# EAGLE design battery_weld (EAGLE 8.0.1)
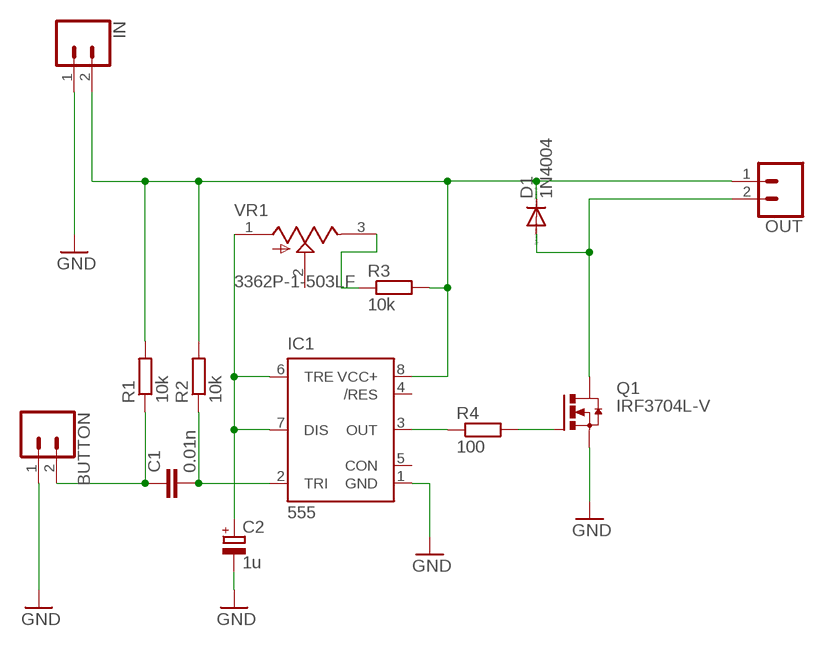
[diagram p0: schematic, sheet 1]

## Parts
BUTTON  CONN_02  [1X02]
C1  0.01n  C-EUC1206K  [C1206K]
C2  1u  CPOL-EUE2-4  [E2-4]
D1  1N4004  [DO41-10]
IC1  555  555D  [SO08]
IN  CONN_025MM  [SCREWTERMINAL-5MM-2]
OUT  CONN_025MM  [SCREWTERMINAL-5MM-2]
Q1  IRF3704L-V  [TO262-V]
R1  10k  R-EU_M1206  [M1206]
R2  10k  R-EU_M1206  [M1206]
R3  10k  R-EU_M1206  [M1206]
R4  100  R-EU_M1206  [M1206]
VR1  3362P-1-503LF  [TRIM_3362P-1-503LF]

## Nets
GND: BUTTON.1 C2.- IC1.1(GND) IN.1 Q1.3(S)
N$1: BUTTON.2 C1.1 R1.1
N$2: C1.2 IC1.2(TRI) R2.1
N$3: C2.+ IC1.6(TRE) IC1.7(DIS) VR1.1(CCW)
N$4: R3.1 VR1.3(CW)
N$6: D1.C IC1.8(VCC+) IN.2 OUT.1 R1.2 R2.2 R3.2
N$7: D1.A OUT.2 Q1.2(D)
N$8: Q1.1(G) R4.2
N$9: IC1.3(OUT) R4.1
Unconnected: IC1.4(/RES) IC1.5(CON) VR1.2(WIPER)

## Library data of the parts
BUTTON = SparkFun-Connectors:CONN_02: Multi connection point. Often used as Generic Header-pin footprint for 0.1 inch spaced/style header connections On any of the 0.1 inch spaced packages, you can populate with these: Break Away Headers - Straight <https://www.sparkfun.com/products/116> (PRT-00116) Break Away Male Headers - Right Angle <https://www.sparkfun.com/products/553> (PRT-00553) Female Headers <https://www.sparkfun.com/products/115> (PRT-00115) Break Away Headers - Machine Pin <https://www.sparkfun.com/products/117> (PRT-00117) Break Away Female Headers - Swiss Machine Pin <https://www.sparkfun.com/products/743> (PRT-00743) For SCREWTERMINALS and SPRING TERMINALS visit here: Screw Terimnals on SparkFun.com <https://www.sparkfun.com/search/results?term=Screw+Terminals> (5mm/3.5mm/2.54mm spacing) This device is also useful as a general connection point to wire up your design to another part of your project. Our various solder wires solder well into these plated through hole pads. Hook-Up Wire - Assortment (Stranded, 22 AWG) <https://www.sparkfun.com/products/11375> (PRT-11375) Hook-Up Wire - Assortment (Solid Core, 22 AWG) <https://www.sparkfun.com/products/11367> (PRT-11367) View the entire wire category on our website here <https://www.sparkfun.com/categories/141> Special notes: Molex polarized connector foot print use with: PRT-08233 with associated crimp pins and housings. 2.54_SCREWTERM for use with PRT-10571. 3.5mm Screw Terminal footprints for PRT-08084 5mm Screw Terminal footprints for use with PRT-08432
C1 = rcl:C-EU: CAPACITOR, European symbol
C2 = rcl:CPOL-EU: POLARIZED CAPACITOR, European symbol
D1 = diode:1N4004: DIODE general purpose rectifier, 1 A
IC1 = SparkFun-IC-Special-Function:555: General purpose bipolar Timer Datasheet <http://www.sparkfun.com/datasheets/Components/General/ne555.pdf> SparkFun Products SparkFun SparkPunk Sequencer Kit <https://www.sparkfun.com/products/12707> (KIT-12707) Storefront Component: 555 Timer <https://www.sparkfun.com/products/9273> (COM-09273) Two parts valid for production: VFP: IC-11930 (M7555 PTH) VFP: IC-09173 (555 PTH) - Preferred; PROD_ID: NA-XXXXX
IN OUT = SparkFun-Connectors:CONN_02: Multi connection point. Often used as Generic Header-pin footprint for 0.1 inch spaced/style header connections On any of the 0.1 inch spaced packages, you can populate with these: Break Away Headers - Straight <https://www.sparkfun.com/products/116> (PRT-00116) Break Away Male Headers - Right Angle <https://www.sparkfun.com/products/553> (PRT-00553) Female Headers <https://www.sparkfun.com/products/115> (PRT-00115) Break Away Headers - Machine Pin <https://www.sparkfun.com/products/117> (PRT-00117) Break Away Female Headers - Swiss Machine Pin <https://www.sparkfun.com/products/743> (PRT-00743) For SCREWTERMINALS and SPRING TERMINALS visit here: Screw Terimnals on SparkFun.com <https://www.sparkfun.com/search/results?term=Screw+Terminals> (5mm/3.5mm/2.54mm spacing) This device is also useful as a general connection point to wire up your design to another part of your project. Our various solder wires solder well into these plated through hole pads. Hook-Up Wire - Assortment (Stranded, 22 AWG) <https://www.sparkfun.com/products/11375> (PRT-11375) Hook-Up Wire - Assortment (Solid Core, 22 AWG) <https://www.sparkfun.com/products/11367> (PRT-11367) View the entire wire category on our website here <https://www.sparkfun.com/categories/141> Special notes: Molex polarized connector foot print use with: PRT-08233 with associated crimp pins and housings. 2.54_SCREWTERM for use with PRT-10571. 3.5mm Screw Terminal footprints for PRT-08084 5mm Screw Terminal footprints for use with PRT-08432; SF_SKU: PRT-08432
Q1 = transistor-power:IRF3704: SMPS MOSFET HEXFET® Power MOSFET Source: http://www.irf.com/product-info/datasheets/data/irf3704.pdf
R1-R4 = resistor:R-EU_: RESISTOR, European symbol
VR1 = 3362P-1-503LF:3362P-1-503LF: Res Cermet Trimmer 50K Ohm 10% 1/2W 1(Elec)/1(Mech)Turn 2.77mm (6.6 X 6.99 X 4.7mm) Pin Thru-Hole Tube; AVAILABILITY: Unavailable; DESCRIPTION: Res Cermet Trimmer 50K Ohm 10% 1/2W 1_Elec_/1_Mech_Turn 2.77mm _6.6 X 6.99 X 4.7mm_ Pin Thru-Hole Tube; MF: Bourns; MP: 3362P-1-503LF; PACKAGE: Bourns; PRICE: None

## Board
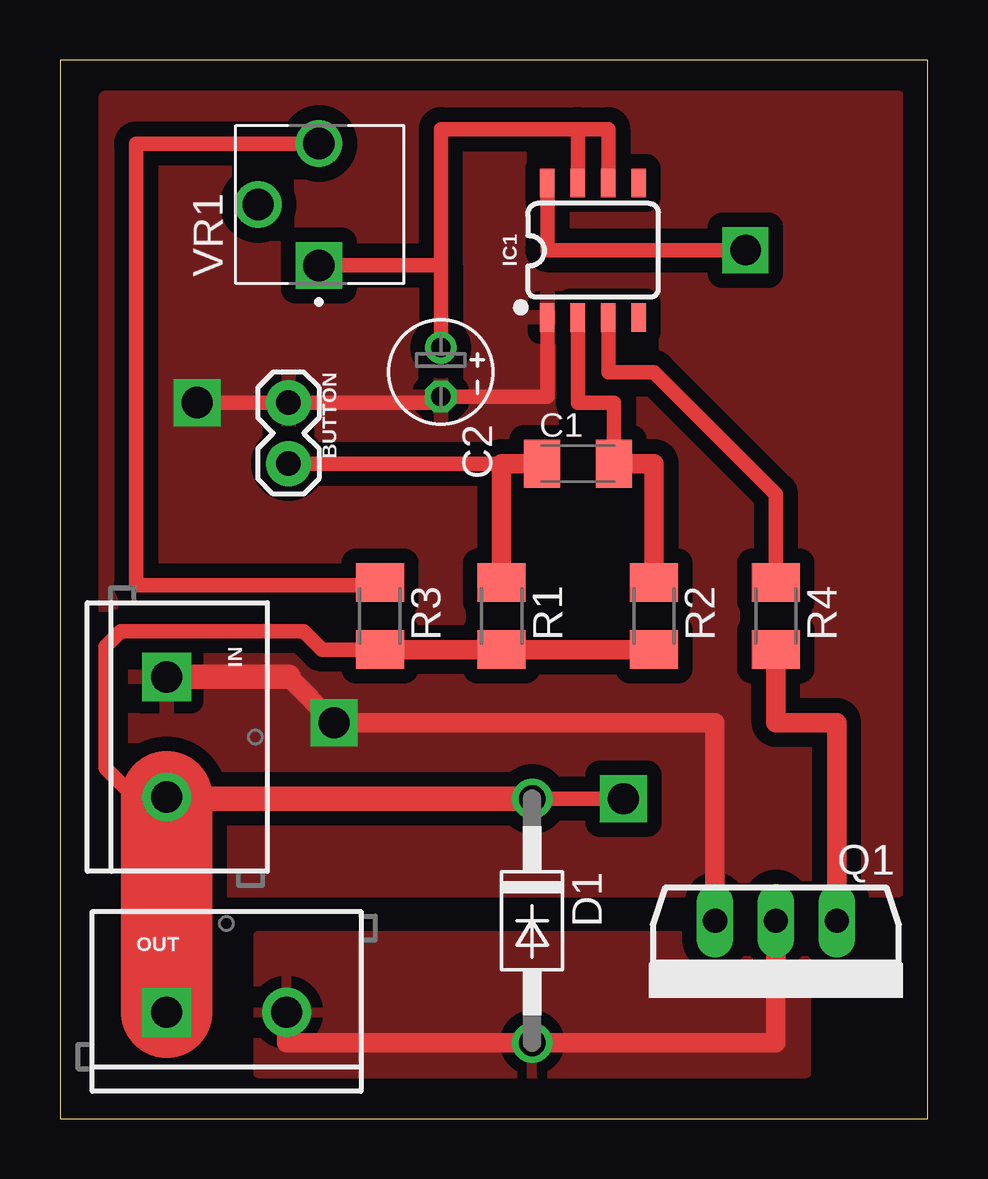
[diagram p1: board, top side]
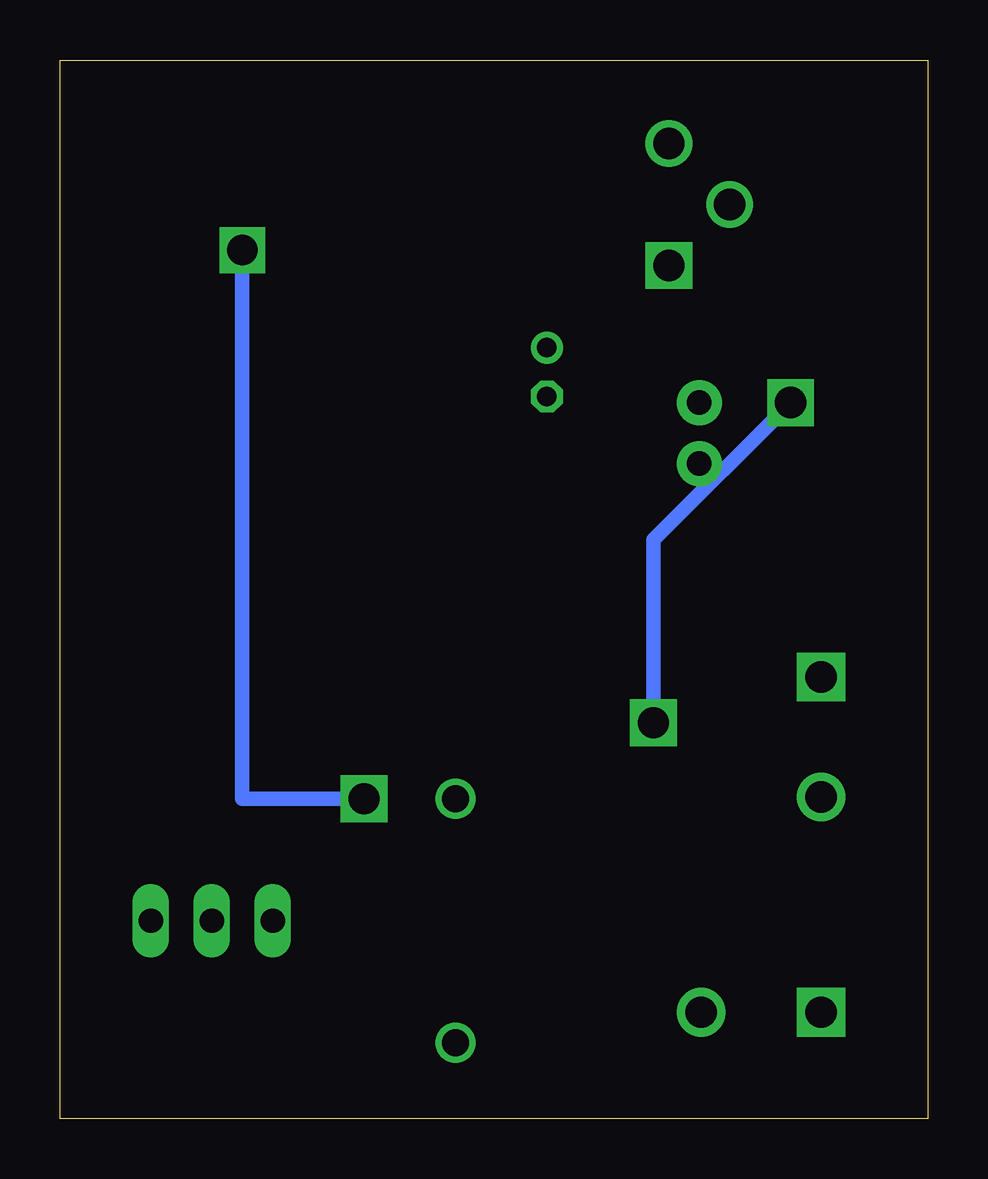
[diagram p2: board, bottom side, seen from below]

Size 36.17 x 44.12 mm. Coordinates in mm from the lower left corner, seen from the top.
Outline: 0,0 36.17,0 36.17,44.12 0,44.12 0,0
Copper layers (1*16): Top 0.035mm / dielectric 1.5mm / Bottom 0.035mm
Design rules "default *": minimum track width 10mil, minimum drill 32mil, track to track 24mil, track to pad 24mil, pad to pad 12mil, via to via 12mil, smd to smd 8mil, copper to edge 40mil, drill to drill 40mil, minimum pad ring 10mil, minimum via ring 8mil, stop-mask expansion 4mil, vias tented up to drill 0mil, thermal gap 20mil

### Footprints (pad centres in the part's own frame; a part is rotated, then mirrored left to right if it is on the bottom)
1X02 = drill 1.016 pad 1.88: 1 0,0; 2 2.54,0
C1206K = smd 1.5 x 2: 1 -1.5,0; 2 1.5,0
E2-4 = drill 0.813 pad 1.27: + -1.016,0 | drill 0.813 pad 1.27 octagon: - 1.016,0
DO41-10 = drill 1.118: A 5.08,0; C -5.08,0
SO08 = smd 0.6 x 1.2: 1 -1.905,-2.8; 2 -0.635,-2.8; 3 0.635,-2.8; 4 1.905,-2.8; 5 1.905,2.8; 6 0.635,2.8; 7 -0.635,2.8; 8 -1.905,2.8
SCREWTERMINAL-5MM-2 = drill 1.3 pad 2.032 square: 1 0,0 | drill 1.3 pad 2.032: 2 5,0
TO262-V = drill 1.016 long: 1 -2.54,0; 2 0,0; 3 2.54,0
M1206 = smd 1.6 x 2: 1 -1.4,0; 2 1.4,0
TRIM_3362P-1-503LF = drill 1.3 pad 1.93 square: 1 -2.54,0 | drill 1.3 pad 1.93: 2 0,2.54; 3 2.54,0

### Placement (x,y rotation side)
BUTTON  9.53,29.84 270 top
C1  21.59,27.3 0 top
C2  15.88,31.11 270 top
D1  19.68,8.26 270 top
IC1  22.23,36.2 0 top
IN  4.45,18.41 270 top
OUT  4.45,4.45 0 top
Q1  29.84,8.26 180 top
R1  18.41,20.95 270 top
R2  24.77,20.95 270 top
R3  13.34,20.95 270 top
R4  29.84,20.95 270 top
VR1  10.79,38.1 90 top

### Tracks (layer width: path | path; a pad name or v marks a point on that pad's centre or on a via)
GND  (via drill 1.3)
  Top 0.61: IC1.1 20.32,30.1 C2.- 15.88,29.84 BUTTON.1 v5.71,29.84
  Top 0.813: Q1.3 27.3,16.51 v11.43,16.51 9.53,18.41
  Top 1.016: IN.1 9.53,18.41
  Bottom 0.61: v5.71,29.84 11.43,24.13 v11.43,16.51
  pour Top: 1.91,42.55 34.92,42.55 34.92,9.53 1.91,9.53
N$1
  Top 0.61: BUTTON.2 18.41,27.3
  Top 0.813: C1.1 18.41,27.3 R1.1
N$2
  Top 0.61: IC1.2 21.59,29.84 23.09,29.84 C1.2
  Top 0.813: C1.2 24.77,27.3 R2.1
N$3
  Top 0.61: 21.59,41.23 15.88,41.23 15.88,35.56 | 21.59,41.23 22.86,41.23 IC1.6 | IC1.7 21.59,41.23 | 15.88,35.56 C2.+ | VR1.1 15.88,35.56
N$4
  Top 0.61: R3.1 13.34,22.23 3.17,22.23 3.17,40.64 VR1.3
N$6  (via drill 1.27 pad 1.27, 1.3)
  Top 0.61: IC1.8 20.32,36.2 v28.57,36.2 | v23.5,13.34 D1.C | R3.2 10.93,19.55 10.16,20.32 2.54,20.32 1.91,19.68 1.91,14.61 3.17,13.34 4.37,13.34 IN.2
  Top 0.813: R2.2 R1.2 R3.2 13.34,19.68
  Top 1.016: D1.C 4.45,13.34 IN.2
  Top 3.81: IN.2 OUT.1
  Bottom 0.61: v23.5,13.34 28.57,13.34 v28.57,36.2
N$7
  Top 0.813: Q1.2 29.84,3.17 D1.A 9.45,3.17 OUT.2
  pour Top: 8.26,7.62 8.26,1.91 31.11,1.91 31.11,7.62
N$8
  Top 0.813: Q1.1 32.38,16.51 29.84,16.51 R4.2
N$9
  Top 0.61: IC1.3 22.86,31.11 24.77,31.11 29.84,26.04 R4.1